# EasyEDA Pro project 扩展30.5V0.25_AT32F435_2025-06-26.epro, board IFLIGHT435/405_0.25
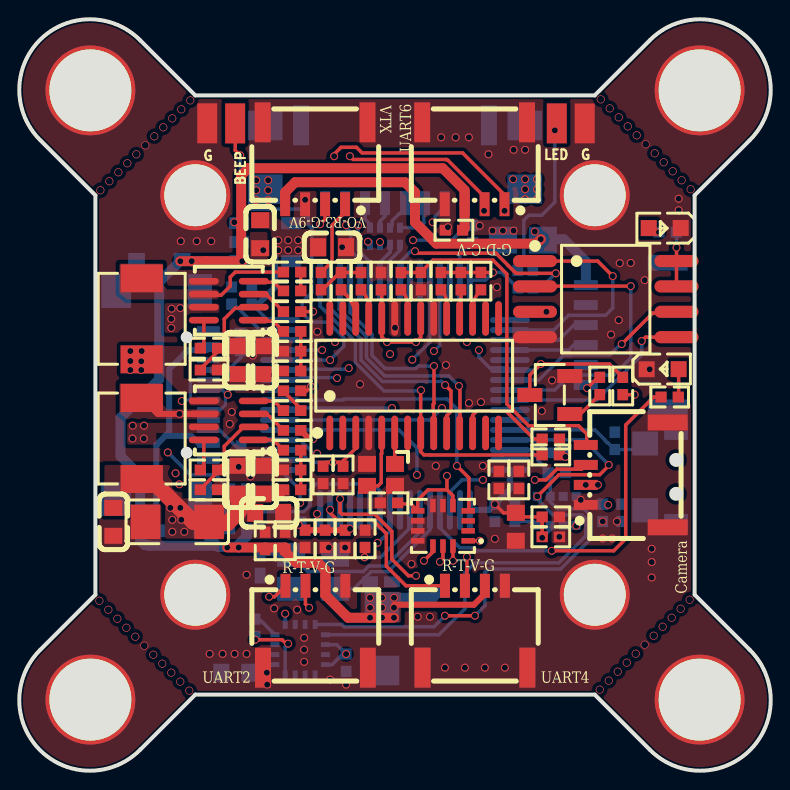
[diagram p1: board, top side]
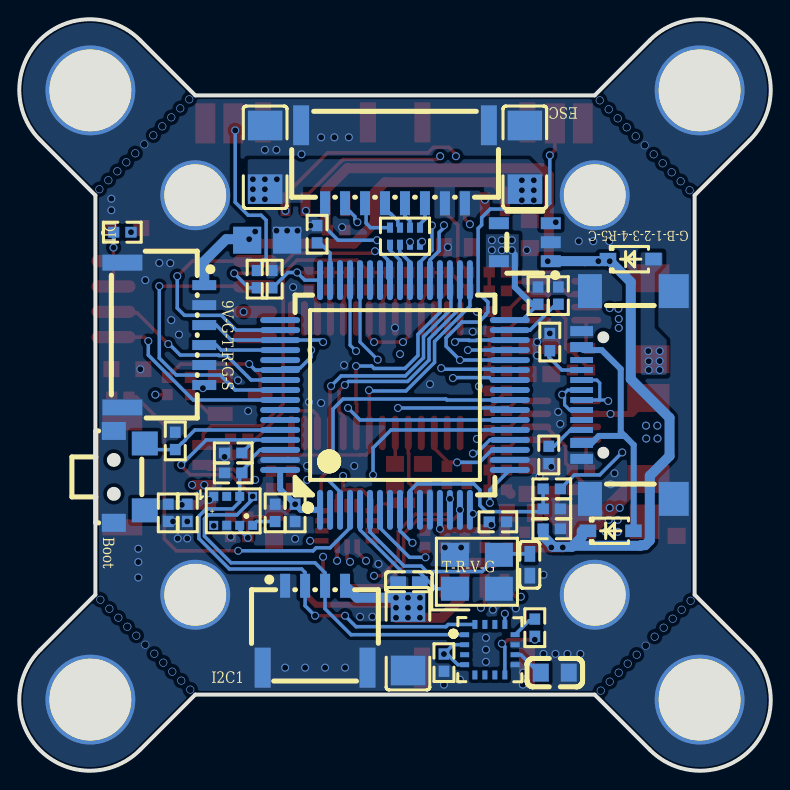
[diagram p2: board, bottom side, seen from below]

Outline 37.62 x 37.62 mm; copper layers: Top Layer, Inner1, Inner2, Bottom Layer. Coordinates in mm from the lower left corner of the outline.
Outline path: 1.06,31.56 arc(1.04,36.59) 6.06,36.56 8.81,33.81 28.81,33.81 31.56,36.56 arc(36.59,36.59) 36.56,31.56 33.81,28.82 33.81,8.81 36.56,6.06 arc(36.59,1.04) 31.56,1.06 28.81,3.81 8.81,3.81 6.06,1.06 arc(1.04,1.04) 1.06,6.06 3.81,8.81 3.81,28.81 1.06,31.56
Stack: Top Layer 0.035mm 外层铜厚1oz / Dielectric1 0.2104mm 7628 RC49% 8.6mil / Inner1 0.0152mm 内层铜厚 / Dielectric2 1.065mm 1.1mm H/HOZ Copper / Inner2 0.0152mm 内层铜厚 / Dielectric3 0.2104mm 7628 RC49% 8.6mil / Bottom Layer 0.035mm 外层铜厚1oz

## Design rules (mm)
net OTG_FS_DP: DP1
net OTG_FS_DM: DP1
template: 自定义配置
spacing copperThickness1oz (default): track to track 0.102, other pairs 0 to 0.3
spacing copperThickness2oz: track to track 0.203, other pairs 0.152 to 0.3
track width copperThickness1oz (default): min 0.127, default 0.175, max 2.54
track width copperThickness2oz: min 0.203, default 0.254, max 2.54
differential pair differentialPair (default): width min 0.127, default 0.16, max 2.54; gap min 0.152, default 0.152
via viaSize (default): diameter min 0.4, default 0.4, max 10; hole min 0.3, default 0.3, max 6.3

## Placement (name value [footprint] x y rotation side)
BEEP  BEEPER  [Test-Point-0.5mm]  10.81 32.41 0 top
C1  100nF  [R0402]  24.96 24.61 90 bottom
C2  100nF  [R0402]  23.81 12.91 270 bottom
C3  100nF  [R0402]  11.65 23.79 90 bottom
C4  100nF  [R0402]  13.66 12.46 180 bottom
C5  100nF  [R0402]  25.01 14.56 90 top
C6  1uF  [R0402]  24.01 14.56 90 top
C7  100nF  [R0402]  12.31 11.51 90 top
C8  100nF  [R0402]  13.31 11.51 90 top
C9  100nF  [R0402]  21.76 27.06 0 top
C10  2.2uF  [R0402]  10.96 12.11 0 bottom
C11  100nF  [C0603]  12.06 26.86 90 top
C12  22uF  [C0603]  15.66 26.21 180 top
C13  100nF  [R0402]  17.31 11.61 90 top
C14  15pF  [C0402#2]  18.11 9.46 180 bottom
C15  15pF  [C0402#2]  12.06 10.31 90 bottom
C16  100nF  [C0402]  9.5 20.07 180 top
C17  100nF  [C0402]  9.5 14.07 180 top
C18  22uF  [C0603]  12.18 20.56 270 top
C19  22uF  [C0603]  10.99 20.56 270 top
C20  22uF  [C0603]  10.99 14.57 270 top
C21  100nF  [C0603]  12.51 12.91 180 top
C22  22uF  [C0603]  12.18 14.57 270 top
C23  47uF  [C1206]  25.31 30.71 270 bottom
C24  47uF  [C1206]  12.31 30.71 270 bottom
C25  100nF  [C0402]  13.66 24.03 0 top
C26  100nF  [C0402]  13.66 18.03 0 top
C27  2.2uF  [R0402]  10.64 23.79 90 bottom
C28  2.2uF  [R0402]  22.71 26.86 90 bottom
C29  47uF  [C1206]  18.16 6.61 90 bottom
C30  47uF  [C1206]  7.91 12.46 0 top
C31  100nF  [C0402]  30.16 12.91 90 bottom
C32  100nF  [C0402]  29.21 12.91 90 bottom
C33  4.7uF  [C0603]  24.86 12.21 90 top
C34  4.7uF  [C0603]  4.71 12.46 270 top
C35  100nF  [C0402]  18.11 24.51 90 top
C36  100nF  [C0402]  15.21 14.81 270 top
C37  100nF  [C0402]  16.21 14.81 270 top
C38  22uF  [C0805]  25.21 26.56 0 bottom
C39  100nF  [C0402]  15.31 11.61 90 top
C40  10nF  [C0402]  16.31 11.61 90 top
C41  100nF  [R0402]  18.51 13.41 180 top
C42  100nF  [R0402]  14.31 11.61 270 top
C43  100nF  [R0402]  26.61 12.71 0 top
C44  100nF  [R0402]  26.61 11.71 0 top
C45  22uF  [C0402]  16.11 24.51 90 top
C46  22uF  [C0402]  17.11 24.51 90 top
C47  100nF  [C0402]  19.11 24.51 90 top
C49  4.7uF  [C0603]  10.81 4.91 180 bottom
C50  100nF  [C0402]  16.36 5.41 270 bottom
C51  220nF  [C0402]  11.81 7.16 270 bottom
CN2  HDGC1002WR-S-4P  [CONN-SMD_4P-P1.00_HDGC_HDGC1002WR-S-4P]  14.81 30.41 180 top
CN3  HDGC1002WR-S-4P  [CONN-SMD_4P-P1.00_HDGC_HDGC1002WR-S-4P]  14.83 7.21 0 top
CN4  HDGC1002WR-S-4P  [CONN-SMD_4P-P1.00_HDGC_HDGC1002WR-S-4P]  30.41 14.81 90 top
CN5  HDGC1002WR-S-4P  [CONN-SMD_4P-P1.00_HDGC_HDGC1002WR-S-4P]  22.81 7.21 0 top
CN6  HDGC1002WR-S-4P  [CONN-SMD_4P-P1.00_HDGC_HDGC1002WR-S-4P]  22.81 7.21 180 bottom
CN7  HDGC1002WR-S-8P  [CONN-SMD_8P-P1.00_HDGC_HDGC1002WR-S-8P]  18.81 30.37 0 bottom
CN9  HDGC1002WR-S-6P  [CONN-SMD_6P-P1.00_HDGC1002WR-S-6P]  30.41 21.81 270 bottom
CN10  HDGC1002WR-S-4P  [CONN-SMD_4P-P1.00_HDGC_HDGC1002WR-S-4P]  22.8 30.41 180 top
D1  BAT60B  [SOD-323_L1.7-W1.3-LS2.6-RD-1]  7.01 25.61 180 bottom
D2  BAT60B  [SOD-323_L1.7-W1.3-LS2.6-RD-1]  8.01 12.01 180 bottom
G  -  [Test-Point-0.5mm]  28.31 32.41 0 top
G#2  -  [Test-Point-0.5mm]  9.41 32.41 0 top
L1  10uH  [IND-SMD_L4.4-W4.2]  6.13 22.63 90 top
L2  10uH  [IND-SMD_L4.4-W4.2]  6.13 16.64 90 top
LED  LED_STRIP  [Test-Point-0.5mm]  26.91 32.41 0 top
LED4  -  [LED_0603]  32.26 27.16 180 top
LED5  -  [LED_0603]  32.26 20.11 0 top
NOREF  -  [Pad_e2428]  3.56 34.06 0 top
NOREF#2  -  [Pad_e188]  8.81 28.81 0 top
NOREF#3  -  [Pad_e187]  8.81 8.81 0 top
NOREF#4  -  [Pad_e183]  28.81 28.81 0 top
NOREF#5  -  [Pad_e2430]  34.06 3.56 0 top
NOREF#6  -  [Pad_e2431]  3.56 3.56 0 top
NOREF#7  -  [Pad_e186]  28.81 8.81 0 top
NOREF#8  -  [Pad_e2429]  34.06 34.06 0 top
Q1  SS8050_C2150  [SOT-23-3_L2.9-W1.3-P1.90-LS2.4-BR]  26.56 18.81 0 top
R1  10kΩ  [R0402]  29.81 16.51 90 bottom
R2  10kΩ  [R0402]  10.96 14.11 180 bottom
R3  1kΩ  [R0402]  10.96 13.11 0 bottom
R4  100kΩ  [R0402]  9.5 21.16 180 top
R5  100kΩ  [R0402]  9.5 15.06 180 top
R6  1MΩ  [R0402]  13.66 22.99 180 top
R7  1MΩ  [R0402]  13.66 17.04 180 top
R8  20Ω  [R0402]  13.66 24.97 0 top
R9  20Ω  [R0402]  13.66 19.02 180 top
R10  10kΩ  [R0402]  26.91 14.91 180 bottom
R11  3kΩ  [R0402]  25.71 24.61 90 bottom
R12  10kΩ  [R0402]  26.91 15.91 180 bottom
R13  3kΩ  [R0402]  32.56 18.71 0 top
R14  3kΩ  [R0402]  32.46 26.96 180 bottom
R15  51kΩ  [R0402]  13.66 22 0 top
R16  41.2kΩ  [R0402]  13.66 20.02 180 top
R17  51kΩ  [R0402]  13.66 16.05 0 top
R18  41.2kΩ  [R0402]  13.66 14.07 180 top
R19  7.68kΩ  [R0402]  13.66 21.01 0 top
R20  4.02kΩ  [R0402]  13.66 15.06 0 top
R21  100kΩ  [R0402]  24.81 12.91 270 bottom
R22  5.1kΩ  [R0402]  11.11 15.81 90 bottom
R23  5.1kΩ  [R0402]  11.06 21.46 270 bottom
R24  1k  [R0402]  26.61 16.61 0 top
R25  1k  [R0402]  22.11 24.51 90 top
R26  1k  [R0402]  23.11 24.51 90 top
R27  10k  [R0402]  21.11 24.51 90 top
R28  10k  [R0402]  26.61 15.81 0 top
R29  10kΩ  [R0402]  30.21 19.26 90 top
R30  75  [R0402]  15.11 24.51 90 top
R31  2K  [R0402]  29.06 19.26 270 top
R32  75  [R0402]  20.11 24.51 270 top
RN1  47Ω  [RES-ARRAY-SMD_0402-8P-L2.0-W1.0-BL]  18.31 26.76 180 bottom
SW1  TS24CA  [SW-SMD_TS24CA]  32.11 14.71 90 bottom
U1  ME6217C33M5G  [SOT-23-5_L3.0-W1.7-P0.95-LS2.8-BR]  12.31 26.46 180 bottom
U2  MP9943GQ-Z  [QFN-8_L3.0-W3.0-P0.65-BL]  10.49 23.54 90 top
U3  MP9943GQ-Z  [QFN-8_L3.0-W3.0-P0.65-BL]  10.49 17.54 90 top
U4  SPL06-001  [SENSOR-SMD_SPL06-001]  26.91 13.01 0 bottom
U5  AT7456E  [AT7456E-SHORTER-FOOTPRINT]  19.77 19.78 0 top
U6  ICM-42688-P  [LGA-14_L3.0-W2.5-P0.50-TL]  21.21 12.26 180 top
U8  STM32F405RGT6/AT32F435RGT6  [LQFP-64_L10.0-W10.0-P0.50-LS12.0-BL]  18.81 18.81 180 bottom
U9  W25Q64JVSSIQ  [SOP-8_L5.3-W5.3-P1.27-LS8.0-BL]  29.36 23.61 270 top
U10  QMC5883L  [LGA-16_L3.0-W3.0-P0.50-BL_SQ]  14.06 6.06 270 bottom
USB1  TYPE-C 16P QTWT  [USB-TYPE-C-SMD_TYPE-C-16P-QTWT]  7.16 18.81 90 bottom
X1  Crystal2016  [CRYSTAL2016]  18.11 14.81 0 top
X2  8MHz  [CRYSTAL-SMD_4P-L3.2-W2.5-BL]  14.71 9.96 180 bottom

## Footprints (pads in the part's own frame, mm; a bottom-side part is the same pattern mirrored in y, then rotated)
AT7456E-SHORTER-FOOTPRINT
  oval 0.343x1.732 smd: 1(-4.225,-2.866) 2(-3.575,-2.866) 3(-2.925,-2.866) 4(-2.275,-2.866) 5(-1.625,-2.866) 6(-0.975,-2.866) 7(-0.325,-2.866) 8(0.325,-2.866) 9(0.975,-2.866) 10(1.625,-2.866) 11(2.275,-2.866) 12(2.925,-2.866) 13(3.575,-2.866) 14(4.225,-2.866) 15(4.225,2.865) 16(3.575,2.865) 17(2.925,2.865) 18(2.275,2.865) 19(1.625,2.865) 20(0.975,2.865) 21(0.325,2.865) 22(-0.325,2.865) 23(-0.975,2.865) 24(-1.625,2.865) 25(-2.275,2.865) 26(-2.925,2.865) 27(-3.575,2.865) 28(-4.225,2.865)
C0402
  rect 0.567x0.54 smd: 1(-0.432,0) 2(0.432,0)
C0402#2
  rect 0.79x0.54 smd: 1(-0.545,0) 2(0.545,0)
C0603
  rect 0.8x0.9 smd: 1(-0.7,0) 2(0.7,0)
C0805
  rect 1.41x1.35 smd: 1(-1,0) 2(1,0)
C1206
  rect 1.485x1.728 smd: 1(-1.593,0) 2(1.593,0)
CONN-SMD_4P-P1.00_HDGC_HDGC1002WR-S-4P
  rect 0.5x1.2 smd: 1(-1.5,2.05) 2(-0.5,2.05) 3(0.5,2.05) 4(1.5,2.05)
  rect 0.8x2 smd: 5(2.625,-2.05) 6(-2.625,-2.05)
CONN-SMD_6P-P1.00_HDGC1002WR-S-6P
  rect 0.5x1.2 smd: 1(-2.5,2.05) 2(-1.5,2.05) 3(-0.5,2.05) 4(0.5,2.05) 5(1.5,2.05) 6(2.5,2.05)
  rect 0.8x2 smd: 7(3.625,-2.05) 8(-3.625,-2.05)
CONN-SMD_8P-P1.00_HDGC_HDGC1002WR-S-8P
  rect 0.5x1.2 smd: 1(-3.5,1.95) 2(-2.5,1.95) 3(-1.5,1.95) 4(-0.5,1.95) 5(0.5,1.95) 6(1.5,1.95) 7(2.5,1.95) 8(3.5,1.95)
  rect 0.8x2 smd: 9(4.7,-1.95) 10(-4.7,-1.95)
CRYSTAL2016
  custom 0.9x0.8 smd: 1(0.7,0.55) 2(-0.7,0.55) 3(-0.7,-0.55) 4(0.7,-0.55)
CRYSTAL-SMD_4P-L3.2-W2.5-BL
  rect 1.4x1.2 smd: 1(-1.1,-0.85) 2(1.1,-0.85) 3(1.1,0.85) 4(-1.1,0.85)
IND-SMD_L4.4-W4.2
  rect 1.4x2.12 smd: 1(2.028,0) 2(-2.028,0)
LED_0603
  rect 0.8x0.8 smd: 1(-0.851,-0.01) 2(0.75,-0.005)
LGA-14_L3.0-W2.5-P0.50-TL
  rect 0.675x0.28 smd: 1(-1.262,0.75) 2(-1.262,0.25) 3(-1.262,-0.25) 4(-1.262,-0.75) 8(1.262,-0.75) 9(1.262,-0.25) 10(1.262,0.25) 11(1.262,0.75)
  rect 0.28x0.675 smd: 5(-0.5,-1.012) 6(0,-1.012) 7(0.5,-1.012) 12(0.5,1.012) 13(0,1.012) 14(-0.5,1.012)
LGA-16_L3.0-W3.0-P0.50-BL_SQ
  rect 0.25x0.45 smd: 1(-0.75,-1.263) 2(-0.25,-1.263) 3(0.25,-1.263) 4(0.75,-1.263) 9(0.75,1.263) 10(0.25,1.263) 11(-0.25,1.263) 12(-0.75,1.263)
  rect 0.45x0.25 smd: 5(1.263,-0.75) 6(1.263,-0.25) 7(1.263,0.25) 8(1.263,0.75) 13(-1.263,0.75) 14(-1.263,0.25) 15(-1.263,-0.25) 16(-1.263,-0.75)
LQFP-64_L10.0-W10.0-P0.50-LS12.0-BL
  oval 0.3x2 smd: 1(-3.75,-5.75) 2(-3.25,-5.75) 3(-2.75,-5.75) 4(-2.25,-5.75) 5(-1.75,-5.75) 6(-1.25,-5.75) 7(-0.75,-5.75) 8(-0.25,-5.75) 9(0.25,-5.75) 10(0.75,-5.75) 11(1.25,-5.75) 12(1.75,-5.75) 13(2.25,-5.75) 14(2.75,-5.75) 15(3.25,-5.75) 16(3.75,-5.75) 33(3.75,5.75) 34(3.25,5.75) 35(2.75,5.75) 36(2.25,5.75) 37(1.75,5.75) 38(1.25,5.75) 39(0.75,5.75) 40(0.25,5.75) 41(-0.25,5.75) 42(-0.75,5.75) 43(-1.25,5.75) 44(-1.75,5.75) 45(-2.25,5.75) 46(-2.75,5.75) 47(-3.25,5.75) 48(-3.75,5.75)
  oval 2x0.3 smd: 17(5.75,-3.75) 18(5.75,-3.25) 19(5.75,-2.75) 20(5.75,-2.25) 21(5.75,-1.75) 22(5.75,-1.25) 23(5.75,-0.75) 24(5.75,-0.25) 25(5.75,0.25) 26(5.75,0.75) 27(5.75,1.25) 28(5.75,1.75) 29(5.75,2.25) 30(5.75,2.75) 31(5.75,3.25) 32(5.75,3.75) 49(-5.75,3.75) 50(-5.75,3.25) 51(-5.75,2.75) 52(-5.75,2.25) 53(-5.75,1.75) 54(-5.75,1.25) 55(-5.75,0.75) 56(-5.75,0.25) 57(-5.75,-0.25) 58(-5.75,-0.75) 59(-5.75,-1.25) 60(-5.75,-1.75) 61(-5.75,-2.25) 62(-5.75,-2.75) 63(-5.75,-3.25) 64(-5.75,-3.75)
Pad_e183
  round 3.5 hole 3.1: 1(0,0)
Pad_e186
  round 3.5 hole 3.1: 1(0,0)
Pad_e187
  round 3.5 hole 3.1: 1(0,0)
Pad_e188
  round 3.5 hole 3.1: 1(0,0)
Pad_e2428
  round 4.5 hole 4.1: 1(0,0)
Pad_e2429
  round 4.5 hole 4.1: 1(0,0)
Pad_e2430
  round 4.5 hole 4.1: 1(0,0)
Pad_e2431
  round 4.5 hole 4.1: 1(0,0)
QFN-8_L3.0-W3.0-P0.65-BL
  oval 0.33x1.5 smd: 1(-0.975,-1.25) 2(-0.325,-1.25) 3(0.325,-1.25) 4(0.975,-1.25) 5(0.975,1.25) 6(0.325,1.25) 7(-0.325,1.25) 8(-0.975,1.25)
R0402
  rect 0.566x0.54 smd: 1(-0.433,0) 2(0.433,0)
RES-ARRAY-SMD_0402-8P-L2.0-W1.0-BL
  rect 0.3x0.505 smd: 1(-0.75,0.427) 2(-0.25,0.427) 3(0.25,0.427) 4(0.75,0.427) 5(0.75,-0.427) 6(0.25,-0.427) 7(-0.25,-0.427) 8(-0.75,-0.427)
SENSOR-SMD_SPL06-001
  rect 0.45x0.45 smd: 1(0.975,-0.725) 2(0.325,-0.725) 3(-0.325,-0.725) 4(-0.975,-0.725) 5(-0.975,0.725) 6(-0.325,0.725) 7(0.325,0.725) 8(0.975,0.725)
SOD-323_L1.7-W1.3-LS2.6-RD-1
  rect 0.83x0.63 smd: 1(-1.14,0) 2(1.14,0)
SOP-8_L5.3-W5.3-P1.27-LS8.0-BL
  oval 0.609x2.204 smd: 1(-1.905,-3.542) 2(-0.635,-3.542) 3(0.635,-3.542) 4(1.905,-3.542) 5(1.905,3.542) 6(0.635,3.542) 7(-0.635,3.542) 8(-1.905,3.542)
SOT-23-3_L2.9-W1.3-P1.90-LS2.4-BR
  rect 1.25x0.7 smd: 1(1,-0.95) 2(1,0.95) 3(-1,0)
SOT-23-5_L3.0-W1.7-P0.95-LS2.8-BR
  rect 1x0.6 smd: 1(1.3,-0.95) 2(1.3,0) 3(1.3,0.95) 4(-1.3,0.95) 5(-1.3,-0.95)
SW-SMD_TS24CA
  rect 0.9x1.2 smd: 1(-2.3,0.775) 2(2.3,0.775)
  rect 1.2x1.3 smd: 3(-1.675,-0.775) 4(1.675,-0.775)
Test-Point-0.5mm
  rect 1x2 smd: 1(0,0)
USB-TYPE-C-SMD_TYPE-C-16P-QTWT
  rect 1.7x1.5 smd: 0(-5.2,-2.309) 0(5.2,-2.309)
  rect 1.7x1.2 smd: 0(-5.2,1.891) 0(5.2,1.891)
  rect 0.5x1.14 smd: A1(-3.2,2.308) A4(-2.4,2.308) A9(2.4,2.308) A12(3.2,2.308)
  rect 0.3x1.14 smd: A5(-1.25,2.308) A6(-0.25,2.308) A7(0.25,2.308) A8(1.25,2.309) B5(1.75,2.308) B6(0.75,2.308) B7(-0.75,2.308) B8(-1.75,2.309)

## Nets
As in the schematic, except:
GND: C1.2 C2.2 C3.2 C4.2 C5.2 C6.2 C7.2 C8.2 C9.1 C10.1 C11.1 C12.1 C13.2 C14.1 C15.1 C16.1 C17.1 C18.1 C19.1 C20.1 C21.1 C22.1 C23.1 C24.1 C27.2 C28.2 C29.1 C30.1 C31.1 C32.1 C33.1 C34.2 C35.2 C36.2 C37.2 C38.1 C39.1 C40.1 C41.2 C42.2 C43.2 C44.2 C49.2 C50.2 CN2.3 CN2.5 CN2.6 CN3.4 CN3.5 CN3.6 CN4.1 CN4.5 CN4.6 CN5.4 CN5.5 CN5.6 CN6.1 CN6.5 CN6.6 CN7.1 CN7.9 CN7.10 CN9.2 CN9.5 CN9.7 CN9.8 CN10.4 CN10.5 CN10.6 G.1 G#2.1 LED4.1 LED5.1 NOREF.1 NOREF#2.1 NOREF#3.1 NOREF#4.1 NOREF#5.1 NOREF#6.1 NOREF#7.1 NOREF#8.1 Q1.2 R1.2 R3.1 R19.1 R20.1 R21.1 R22.1 R23.1 R32.2 SW1.1 SW1.2 U1.2 U2.5 U3.5 U4.1 U4.7 U5.4 U5.20 U5.23 U6.6 U6.7 U6.9 U6.10 U6.11 U8.12 U8.18 U8.63 U9.4 U10.9 U10.11 USB1.0 USB1.A1 USB1.A12 X1.2 X1.4 X2.2 X2.4
BEEPER: BEEP.1 U8.28
$1N22855: LED.1 R11.2

Pads without a net: U1 4; U4 2; U5 1 2 7 13 14 15 16 27 28; U6 2 3; U8 2 8 11 46 49; U10 3 5 6 7 14 15; USB1 A5 B5

## Via types
v1: diameter 0.4, hole 0.35, Top Layer to Bottom Layer, 44 vias
v2: diameter 0.4, hole 0.3, Top Layer to Bottom Layer, 224 vias

## Routing (per net, layer and track width the routed paths; a pad name or vN(x,y) marks a point on that pad's centre or on a via; arc(x,y) is an arc through that point)
4V5: length 65.6
  Top Layer w0.3: CN5.3 23.31,8.86 22.76,8.31 18.76,8.31
  Top Layer w0.5: 9.32,25.51 v2(8.06,25.51) ; 9.32,25.51 v2(11.17,25.51) 11.11,25.57 11.11,29.81 11.47,30.17 21.2,30.17 22.3,29.07 CN10.3 22.3,27.17 22.2,27.06 ; 9.32,25.51 9.31,25.51 ; v2(18.76,7.66) v2(18.16,7.66) v2(17.56,7.66) 16.46,7.66 15.33,8.8 CN3.3 15.33,10.05 14.96,10.41 13.86,10.41 13.31,10.96 13.31,11.18 v2(10.99,11.18) v2(10.41,11.18)
  Bottom Layer w0.5: 9.9,11.26 9.95,11.21 10.86,11.21 11.4,11.75 C10.2 ; 9.9,11.26 6.51,11.26 6.48,11.3 6.29,11.3 6.06,11.53 6.06,14.77 5.07,15.76 5.07,17.67 7.01,19.61 7.01,24.47 D1.1 8.25,25.51 v2(8.63,25.51) U1.1 ; 9.9,11.26 9.46,11.71 9.47,11.72 9.47,12.01 ; v2(18.76,8.66) 20.71,8.66 CN6.4
  vias: v2(10.76,27.46) v2(17.56,8.66) v2(17.56,8.16) v2(18.16,8.66) v2(18.16,8.16) v2(18.76,8.16)
5V_BEC: length 1.1
  Top Layer w0.175: R16.2 12.38,20.02 12.18,19.81
  vias: v2(5.56,21.01) v2(5.56,20.51) v2(5.56,20.06) v2(6.13,21.01) v2(6.11,20.5) v2(6.11,20.06)
5V_USB: length 13.2
  Bottom Layer w0.3: 7.31,16.76 8.61,16.76 8.96,16.41 9.52,16.41 ; 7.31,16.76 7.51,16.96 7.51,20.11 8.46,21.06 9.37,21.06 9.52,21.21 ; 7.31,16.76 6.86,16.31 6.86,12.02 D2.2
9V_BEC: length 96.5
  Top Layer w0.5: v2(26.11,26.61) 25.89,26.39 20.88,26.39 19.81,27.46 19.81,28.96 19.31,29.46 13.81,29.46 13.31,28.96 CN2.4 ; R18.2 13.03,13.87
  Top Layer w0.8: C20.2 10.99,12.96 10.42,12.4 9.57,12.4 C30.2 8.71,12.46 6.57,14.61 L2.2
  Inner2 w0.7: 27.9,14.31 v2(28.36,14.31) v2(28.97,14.31)
  Inner2 w0.8: 28.26,14.36 28.26,16.01 27.68,16.6 27.68,25.65 ; 27.68,25.65 28.91,25.65 31.12,27.86 31.12,29.77 28.07,32.81 9.56,32.81 4.56,27.82 4.56,14.81 6.81,12.56 v2(7.66,12.56) v2(8.11,12.56) 8.86,12.56 ; 27.68,25.65 26.71,26.61 v2(26.11,26.61) 25.81,26.91 v2(25.81,27)
  Bottom Layer w0.5: CN9.1 28.36,25.51 27.26,26.61 v2(26.11,26.61)
  Bottom Layer w0.8: v2(26.11,26.61) 26.16,26.56 C38.2
  vias: v2(7.56,13.16) v2(7.66,11.96) v2(8.06,13.16) v2(8.26,11.96)
GND: length 0.9
  Top Layer w0.175: 18.8,22.65 18.8,23.56
  vias: v1(6.26,6.26) v1(6.31,31.31) v1(31.31,6.31) v1(31.36,31.36) v2(7.83,14.9) v2(8.02,14.34) v2(8.09,26.51) v2(8.89,26.51) v2(9.54,5.85) v2(9.61,26.51) v2(10.18,5.85) v2(10.54,17.37) v2(10.64,17.97) v2(10.78,5.85) v2(11.06,21.9) v2(10.99,15.22) v2(11.38,9.81) v2(11.38,5.85) v2(11.58,14.74) v2(11.7,21.46) v2(11.7,20.79) v2(12.21,26.06) v2(12.4,4.91) v2(12.41,4.31) v2(12.76,8.13) v2(13.91,8.06) v2(14.26,6.66) v2(14.26,6.06) v2(14.26,5.45) v2(14.31,28.59) v2(14.92,21.98) v2(15.5,11.18) v2(15.56,4.56) v2(16.16,26.21) v2(16.31,11.18) v2(16.36,4.31) v2(17.06,19.36) v2(18.81,22.18) v2(19.64,10.36) v2(19.95,7.71) v2(20.56,7.71) v2(20.85,15.26) v2(21.12,31.71) v2(21.31,5.16) v2(21.36,20.31) v2(21.46,27.22) v2(21.85,31.71) v2(22.31,5.16) v2(22.51,31.71) v2(22.51,18.41) v2(23.06,27.29) v2(23.12,18.46) v2(23.21,15.26) v2(23.31,5.16) v2(23.5,30.87) v2(23.7,27.04) v2(23.81,11.61) v2(23.91,24.21) v2(24.21,27.04) v2(24.31,5.16) v2(24.75,31.09) v2(24.75,27.04) v2(25.33,31.09) v2(26.16,18.01) v2(26.68,19.55) v2(27.04,11.71) v2(28.11,13.56) v2(29.21,12.48) v2(29.21,11.63) v2(29.63,21.84) v2(29.69,11.63) v2(29.93,12.48) v2(30.06,25.41) v2(30.01,22.56) v2(30.61,25.43) v2(31.31,24.56) v2(31.56,20.1) v2(31.66,11.11) v2(31.66,10.45) v2(31.66,9.68) v2(33.01,28.64) v2(33.01,28.06)
VBAT: length 37.9
  Top Layer w0.175: R6.1 v2(14.71,22.99)
  Top Layer w0.3: v2(14.71,16.61) 14.53,16.61 R7.1
  Inner2 w0.175: v2(7.44,15.94) 6.76,16.61 ; v2(14.71,22.99) 8.24,22.99 v2(8.06,23.16)
  Inner2 w0.5: v2(6.24,16.64) 6.26,16.61 8.13,16.61 8.14,16.63 8.73,16.63 8.74,16.61 v2(14.71,16.61)
  Inner2 w0.8: 11.86,28.46 11.86,27.37 v2(7.63,23.13)
  Inner2 w1: 5.96,16.16 5.96,18.23 6.99,19.25 6.99,22.14 7.63,22.78 v2(7.63,23.13) ; 11.81,28.51 v2(11.86,28.56) v2(11.86,29.06) v2(11.86,29.56) v2(12.46,29.56) ; 11.86,28.51 11.86,28.46
  Bottom Layer w0.175: R2.2 9.83,14.81 8.56,14.81 v2(7.44,15.94)
  vias: v2(5.68,17.28) v2(5.67,16.64) v2(6.25,17.28) v2(7.61,22.62) v2(7.61,22.17) v2(12.46,29.06) v2(12.46,28.56) v2(24.73,29.62) v2(25.33,29.62) v2(25.33,29.12) v2(25.33,28.62) v2(25.93,29.62) v2(25.93,29.12) v2(25.93,28.62)
VDD_MCU: length 44
  Top Layer w0.175: R29.1 v2(30.81,18.83) ; U9.7 U9.8 v2(32.91,26.19) ; U5.3 16.85,16.15 16.21,15.51 C37.1 16.02,15.44 v2(15.7,15.44) 15.41,15.44 C36.1 ; 21.42,14.06 20.46,14.06 19.95,13.55 U6.8 19.6,13.36 18.95,13.36 ; 21.42,14.06 21.71,13.77 U6.5 ; 21.42,14.06 21.41,14.07 v2(21.41,14.76) ; 20.1,22.65 20.1,21.7 v2(19.86,21.46) v2(18.41,21.46) 18.15,21.73 18.15,24.05 C35.1 ; v2(26.18,11.66) C44.1 C43.1 25.06,12.71 C33.2 24.25,12.91 v2(23.81,13.35) ; 27.05,16.71 27.05,15.71 ; 21.11,24.95 v2(23.71,24.95)
  Top Layer w0.3: C40.2 C39.2 C42.1
  Bottom Layer w0.175: U8.19 13.97,16.06 14.59,15.44 v2(15.7,15.44) ; U4.6 26.59,12.07 v2(26.18,11.66) ; 32.9,26.86 32.91,26.86 v2(32.91,26.19) ; U10.4 15.66,5.31 16.2,5.85 v2(16.36,5.85) 15.9,6.31 U10.2 ; U10.13 v2(13.31,7.86) ; 11.65,23.36 12.44,22.56 U8.32 ; U8.48 23.33,24.56 v2(23.71,24.95) 24.17,24.95 24.94,24.18 24.96,24.18 ; U4.8 v2(27.89,12.26)
  Bottom Layer w0.3: 11.65,23.36 11.96,23.36 12.81,24.21 12.81,25.86 ; U8.1 23.42,13.06 23.42,13.07 23.53,13.07 v2(23.81,13.35) 24.56,14.1 U8.64
  vias: v2(12.97,26.56) v2(12.97,26.06) v2(13.47,26.56) v2(13.47,26.06) v2(13.97,26.56) v2(13.97,26.06) v2(13.99,12.31) v2(16.56,12.11) v2(26.39,22.98) v2(27.35,15.72) v2(29.49,13.31)
(no net):
  vias: v1(4.06,29.06) v1(4.01,8.51) v1(4.51,29.51) v1(4.46,8.06) v1(4.91,7.61) v1(4.96,29.96) v1(5.41,30.41) v1(5.36,7.16) v1(5.81,6.71) v1(5.86,30.86) v1(6.76,31.76) v1(6.71,5.81) v1(7.16,5.36) v1(7.21,32.21) v1(7.66,32.66) v1(7.61,4.91) v1(8.06,4.46) v1(8.11,33.11) v1(8.51,4.01) v1(8.56,33.56) v1(29.06,4.06) v1(29.11,33.61) v1(29.51,4.51) v1(29.56,33.16) v1(30.01,32.71) v1(29.96,4.96) v1(30.41,5.41) v1(30.46,32.26) v1(30.91,31.81) v1(30.86,5.86) v1(31.76,6.76) v1(31.81,30.91) v1(32.26,30.46) v1(32.21,7.21) v1(32.66,7.66) v1(32.71,30.01) v1(33.16,29.56) v1(33.11,8.11) v1(33.61,29.11) v1(33.56,8.56)
BEEPER: length 19.4
  Top Layer w0.175: BEEP.1 10.81,32.41 10.81,31.06 v2(11.06,30.81)
  Bottom Layer w0.175: U8.28 v2(15.56,20.56) 16.25,21.25 16.25,21.68 15.46,22.46 14.62,22.46 14.28,22.81 14.28,22.85 14.16,22.96 14.16,23.46 14.65,23.95 14.65,27.16 14.48,27.33 14.48,27.69 14.04,28.13 11.37,28.13 11.06,28.43 v2(11.06,30.81)
BOOT: length 7.3
  Bottom Layer w0.175: SW1.4 31.03,16.08 R1.1 29.47,16.43 29.45,16.43 29.31,16.57 29.31,16.59 28.83,17.06 U8.60
CAM: length 17.5
  Top Layer w0.175: C47.2 20.1,24.95 20.71,25.56 23.72,25.56 24.41,24.87 24.41,18.36 25.5,17.28 28,17.28 28.41,16.86 28.41,16.36 CN4.4
FB_5V: length 1.7
  Top Layer w0.175: R15.1 12.72,22.51 11.74,22.51
FB_9V: length 1.7
  Top Layer w0.175: U3.1 12.72,16.57 R17.1
I2C1_SCL: length 30.6
  Top Layer w0.175: v2(25.94,13.74) 27.03,14.83 29.06,14.83 29.51,15.28 v2(29.51,15.31)
  Bottom Layer w0.175: U10.1 21.01,6.81 22.31,8.11 CN6.3 22.31,9.91 22.81,10.41 27.02,10.41 28.35,11.75 28.35,12.61 28.31,12.65 28.31,12.66 28.16,12.81 26.73,12.81 25.94,13.6 v2(25.94,13.74) ; 25.83,16.56 R12.2 ; 25.83,16.56 28.26,16.56 v2(29.51,15.31) ; 25.83,16.56 U8.61
I2C1_SDA: length 24.1
  Top Layer w0.175: v2(21.31,7.76) v2(22.81,7.76)
  Bottom Layer w0.175: v2(22.81,7.76) 23.31,8.26 CN6.2 23.31,9.93 23.49,10.1 27.1,10.1 28.63,11.63 28.63,12.75 28.27,13.11 26.94,13.11 26.59,13.46 U4.3 26.59,14.81 R10.2 26.48,15.02 25.96,15.55 25.96,15.67 25.56,16.06 U8.62 ; v2(21.31,7.76) 20.76,7.21 16.26,7.21 16.15,7.33 U10.16
LC_5V: length 4.7
  Top Layer w0.175: 9.24,23.81 10.11,23.81 10.56,24.26 10.56,24.71 10.82,24.97 R8.1
LC_9V: length 12.1
  Top Layer w0.175: R9.1 14.39,19.02 v2(14.61,19.25)
  Top Layer w0.3: 9.24,17.87 v2(8.03,17.87) 6.93,17.87 L2.1
  Inner1 w0.175: v2(8.03,17.87) 9.08,16.81 12.13,16.81 14.56,19.25 v2(14.61,19.25)
LED0: length 19
  Top Layer w0.175: v2(26.66,11.01) 29.76,11.01 30.36,11.61 30.36,17.31 31.76,18.71 R13.1
  Bottom Layer w0.175: v2(26.66,11.01) 22.91,11.01 22.76,11.16 22.06,11.16 21.06,12.16 U8.4
LED_STRIP: length 10.8
  Top Layer w0.175: v2(19.81,26.01) 19.91,25.91 23.86,25.91 24.48,25.3 24.48,25.29 24.8,24.98 24.8,24.98 24.87,24.91 v2(26.86,24.91)
  Bottom Layer w0.175: v2(26.86,24.91) 26.14,24.18 25.71,24.18 ; U8.41 19.18,24.68 19.18,25.58 19.61,26.01 v2(19.81,26.01)
MCU_OSCI: length 7
  Bottom Layer w0.175: X2.1 16.76,9.11 17.62,9.97 18.47,9.97 20.56,12.06 U8.5
MCU_OSCO: length 10.3
  Bottom Layer w0.175: U8.6 20.06,11.96 18.36,10.25 17.5,10.25 17.23,9.98 14.45,9.98 X2.3 13.57,10.86 C15.2
NRST: length 4.3
  Top Layer w0.175: 17.31,11.18 17.31,10.71 v2(17.29,10.69)
  Bottom Layer w0.175: U8.7 19.56,12.16 18.09,10.69 v2(17.29,10.69)
OSD_HSYNC: length 1.5
  Top Layer w0.175: R25.1 22.11,22.8 arc(22.1,22.72) 22.05,22.65
OSD_LOS: length 5
  Top Layer w0.175: R24.1 25.77,16.61 24.37,18.02 22.92,18.02 22.7,17.8 22.7,16.92
OSD_OSCI: length 3.3
  Top Layer w0.175: X1.3 17.96,14.26 18.13,14.43 18.13,15.86 18.15,15.89 U5.5
OSD_OSCO: length 1.6
  Top Layer w0.175: U5.6 18.8,15.38 X1.1
OSD_RST: length 1.5
  Top Layer w0.175: 21.4,22.65 21.4,23.39 arc(21.33,23.77) R27.1
OSD_SAG: length 1.5
  Top Layer w0.175: 17.5,22.65 17.5,23.15 arc(17.4,23.66) C46.1
OSD_VOUT: length 1.7
  Top Layer w0.175: C45.1 16.35,23.84 arc(16.72,23.29) 16.85,22.65
OSD_VSYNC: length 1.5
  Top Layer w0.175: 22.7,22.65 22.7,23.08 arc(22.81,23.62) R26.1
OTG_FS_DM: length 20.6
  Inner2 w0.16: v2(10.44,18.83) 12.03,18.83 arc(12.08,18.85) 12.09,18.89 arc(12.11,18.94) 12.15,18.95 12.43,18.95 arc(12.48,18.94) 12.49,18.89 12.49,18.07 arc(12.69,17.87) 12.89,18.07 12.89,18.89 arc(12.91,18.94) 12.95,18.95 13.23,18.95 arc(13.28,18.94) 13.29,18.89 13.29,18.07 arc(13.49,17.87) 13.69,18.07 13.69,18.63 arc(13.75,18.77) 13.89,18.83 14.42,18.83 14.43,18.81 14.79,18.81 14.81,18.83 17.93,18.83 v2(19.68,20.58)
  Bottom Layer w0.16: 9.52,18.06 10.07,18.06 10.32,18.32 10.32,18.71 v2(10.44,18.83) 10.4,18.83 10.16,19.06 9.52,19.06 ; v2(19.68,20.58) 20.56,21.47 U8.44
OTG_FS_DP: length 21.1
  Inner2 w0.16: v2(8.14,18.51) 8.89,19.26 13.96,19.26 14.41,19.71 15.06,19.71 15.61,19.16 16.26,19.16 16.63,19.53 16.63,19.54 16.89,19.79 16.89,19.79 17.01,19.91 18.31,19.91 19.41,21.01 v2(20.76,21.01)
  Bottom Layer w0.16: 8.58,18.56 8.56,18.58 8.56,19.41 8.71,19.56 9.52,19.56 ; 8.58,18.56 9.52,18.56 ; 8.58,18.56 8.19,18.56 v2(8.14,18.51) ; U8.45 21.06,21.31 v2(20.76,21.01)
PINIO1: length 8.3
  Top Layer w0.175: v2(25.81,14.56) 26.37,14.56 26.91,15.1 28.15,15.1 CN4.3
  Inner2 w0.175: v2(25.81,14.56) v2(23.21,14.56)
  Bottom Layer w0.175: v2(23.21,14.56) 22.16,14.56 21.56,13.97 U8.3
PWM_1: length 10.4
  Inner2 w0.175: v2(17.46,26.49) 17.46,22.49 16.01,21.04 16.01,19.76 v2(15.91,19.66)
  Bottom Layer w0.175: v2(15.91,19.66) 15.89,19.69 14.09,19.69 13.96,19.56 U8.26
PWM_2: length 10.4
  Inner2 w0.175: v2(16.5,20.16) 16.5,21.14 18.06,22.7 v2(18.06,26.47)
  Bottom Layer w0.175: U8.27 13.1,20.1 16.45,20.1 v2(16.5,20.16)
PWM_3: length 2
  Bottom Layer w0.175: U8.39 18.06,25.47 18.45,25.85 18.46,25.85 18.58,25.97 18.58,26.32 RN1.7
PWM_4: length 2
  Bottom Layer w0.175: U8.40 18.56,25.56 19.06,26.06 RN1.8
PWM_7: length 2.1
  Bottom Layer w0.175: U8.29 v2(15.16,21.06)
PWM_8: length 2.8
  Bottom Layer w0.175: U8.30 14.72,21.56 14.74,21.54 15.11,21.54 15.13,21.56 15.71,21.56 v2(15.81,21.46)
RX_PPM_PIN: length 8.8
  Top Layer w0.175: v2(12.51,8.71) 12.78,8.71 CN3.1
  Inner2 w0.175: v2(14.06,13.41) 14.06,13.31 14.43,12.95 14.43,10.63 v2(12.51,8.71)
  Bottom Layer w0.175: U8.17 14.06,14.06 v2(14.06,13.41)
SBUS: length 0.9
  Top Layer w0.175: v2(28.43,19.16) 28.97,19.7 R31.1
SDCARD_CS: length 11.4
  Top Layer w0.175: v2(29.71,24.76) 28.96,25.52 U9.1
  Bottom Layer w0.175: U8.50 26.76,22.06 27.5,22.8 29.35,22.8 29.71,23.16 v2(29.71,24.76)
SENS_CUR1: length 22.7
  Inner1 w0.175: v2(18.56,20.86) 19.21,20.21 19.21,12.69 v2(17.94,11.41)
  Inner2 w0.175: v2(19.71,26.56) 19.41,26.56 19.24,26.39 19.24,25.89 19.41,25.71 19.41,21.71 v2(18.56,20.86)
  Bottom Layer w0.175: CN7.8 22.31,27.79 22.21,27.68 22.21,27.11 21.66,26.56 v2(19.71,26.56) ; 17.96,11.41 18.56,12.01 U8.9
SENS_VOL: length 9.8
  Bottom Layer w0.175: R2.1 R3.2 11.54,12.98 14.25,12.98 14.56,13.29 14.56,14.06 14.86,14.36 17.71,14.36 18.06,14.01 U8.10
SPI1_IMU1_CS: length 13
  Top Layer w0.175: v2(20.26,10.51) 20.71,10.96 U6.12
  Inner2 w0.175: v2(14.91,15.88) 18.2,15.88 20.79,13.29 20.79,11.04 v2(20.26,10.51)
  Bottom Layer w0.175: v2(14.91,15.88) 14.75,15.88 14.06,16.56 U8.20
SPI1_IMU1_EXTI: length 14.5
  Top Layer w0.175: v2(21.91,15.26) 22.51,14.66 22.51,13.05 U6.4
  Bottom Layer w0.175: v2(21.91,15.26) 21.91,18.11 21.41,18.61 16.26,18.61 16.21,18.56 U8.24 13.12,18.61
SPI1_MISO: length 16.4
  Top Layer w0.175: U6.1 v2(23.06,11.51)
  Inner2 w0.175: v2(23.06,11.51) 22.76,11.81 22.76,15.91 21.16,17.51 v2(21.16,18.16)
  Bottom Layer w0.175: v2(21.16,18.16) 20.56,17.56 U8.22
SPI1_MOSI: length 15.3
  Top Layer w0.175: U6.14 v2(21.71,10.51)
  Inner2 w0.175: v2(21.71,10.51) 21.34,10.89 21.34,14.09 18.66,16.76 v2(18.66,18.16)
  Bottom Layer w0.175: U8.23 13.17,18.16 v2(18.66,18.16)
SPI1_SCLK: length 14.2
  Top Layer w0.175: v2(21.06,10.46) 21.21,10.61 U6.13
  Inner2 w0.175: v2(19.91,14.81) 21.06,13.66 v2(21.06,10.46)
  Bottom Layer w0.175: U8.21 19.01,17.06 19.91,16.16 v2(19.91,14.81)
SPI2_MISO: length 12.1
  Top Layer w0.175: v2(22.01,19.26) 22.01,19.26 22.07,19.21 22.07,16.93 U5.11
  Bottom Layer w0.175: v2(22.01,19.26) 21.51,19.77 18.29,19.77 17.39,20.68 17.39,21.73 16.01,23.11 16.01,24.51 U8.35
SPI2_MOSI: length 11
  Top Layer w0.175: v2(20.76,20.26) 20.76,18.39 20.73,18.35 20.73,17.98 20.76,17.94 20.76,16.93 U5.9
  Bottom Layer w0.175: v2(20.76,20.26) 19.98,20.26 19.86,20.14 18.31,20.14 17.66,20.79 17.66,21.85 16.56,22.95 U8.36
SPI2_SCLK: length 12
  Top Layer w0.175: v2(21.33,19.31) 21.61,19.02 21.61,17.99 21.4,17.78 U5.10
  Bottom Layer w0.175: v2(21.33,19.31) 21.14,19.49 18.18,19.49 17.11,20.56 17.11,21.61 15.56,23.16 U8.34
SPI3_MISO: length 15.1
  Top Layer w0.175: U9.2 25.84,24.26 v2(30.61,24.26)
  Bottom Layer w0.175: v2(30.61,24.26) 30.61,20.66 29.76,19.81 27.56,19.81 26.81,19.06 U8.56
SPI3_MOSI: length 10.1
  Top Layer w0.175: U9.5 31.36,21.71 v2(31.16,21.51)
  Bottom Layer w0.175: U8.57 28.91,18.56 31.16,20.81 v2(31.16,21.51)
SPI3_SCLK: length 8.6
  Top Layer w0.175: v2(30.16,21.36) 31.71,22.91 31.81,22.91
  Bottom Layer w0.175: v2(30.16,21.36) 30.11,21.36 29.56,20.81 27.66,20.81 27.63,20.79 27.24,20.79 26.01,19.56 U8.55
SPI_OSD_CS: length 18
  Top Layer w0.175: R28.1 24.17,15.81 24.17,15.81 20.58,15.81 20.58,15.81 20.26,15.81 20.1,15.98 U5.8 20.1,19.04 v2(20.11,19.05)
  Bottom Layer w0.175: v2(20.11,19.05) 20.08,19.02 18.26,19.02 16.83,20.45 16.83,21.5 15.06,23.26 U8.33
UART2_TX: length 6.1
  Top Layer w0.175: CN3.2 14.33,8.35 v2(14.51,8.16)
  Inner2 w0.175: v2(14.51,8.16) 14.51,8.21 15.01,8.71 15.01,12.76 v2(14.91,12.86)
UART3_RX: length 3.9
  Bottom Layer w0.175: CN9.4 27.76,21.31 27.51,21.06 U8.52
UART3_TX: length 19.7
  Top Layer w0.175: CN2.2 15.31,27.61 v2(15.06,27.36)
  Inner2 w0.175: v2(15.06,27.36) 15.06,27.04 15.29,26.81 17.11,26.81 17.3,27 19.9,27 19.94,26.96 20.56,26.96 22.41,25.11 v2(22.41,21.46)
  Bottom Layer w0.175: v2(22.41,21.46) 22.51,21.56 U8.51 27.01,21.56 27.76,22.31 CN9.3
UART4_RX: length 8.4
  Top Layer w0.175: v2(15.56,13.06) 15.56,12.91 15.91,12.57 ; 15.91,12.57 17.68,12.57 18.38,11.87 18.38,10.25 19.36,9.26 CN5.1
UART4_TX: length 11.2
  Top Layer w0.175: v2(16.06,13.61) 16.06,12.95 16.16,12.85 17.8,12.85 18.66,11.99 18.66,10.6 19.49,9.76 v2(19.86,9.76) ; CN5.2 22.41,9.36 v2(22.41,10.71)
  Inner2 w0.175: v2(19.86,9.76) 21.66,9.76 22.41,10.51 v2(22.41,10.71)
UART5_RX: length 18.7
  Top Layer w0.175: Q1.3 25.56,19.81 v2(26.11,20.36) 29.55,20.36 R29.2
  Inner2 w0.175: v2(23.01,21.06) 23.01,24.91 20.7,27.22 v2(20.7,27.46)
  Bottom Layer w0.175: v2(26.11,20.36) 25.81,20.06 U8.54 24.45,20.18 23.55,20.18 23.01,20.71 v2(23.01,21.06) ; v2(20.7,27.46) 20.83,27.59 20.83,27.75 21.08,28.01 21.29,28.01 21.31,28.03 CN7.7
UART6_RX: length 14.6
  Top Layer w0.175: v2(16.55,30.77) 16.72,30.61 21.39,30.61 21.43,30.56 21.46,30.56 23.3,28.73 CN10.2
  Inner2 w0.175: v2(16.55,30.77) 16.97,30.36 v2(16.97,27.3)
  Bottom Layer w0.175: v2(16.97,27.3) 16.97,26.06 17.56,25.47 U8.38
  vias: v2(23.27,28.04)
UART6_TX: length 17.4
  Top Layer w0.175: v2(15.76,30.77) 15.76,30.86 16.11,31.21 16.89,31.21 17.17,30.93 22.2,30.93 24.4,28.73 24.4,28.14 v2(24.3,28.04)
  Inner2 w0.175: v2(16.36,27.31) 16.36,30.21 15.81,30.77 v2(15.76,30.77)
  Bottom Layer w0.175: U8.37 17.06,25.57 16.6,26.03 16.6,26.95 16.36,27.19 v2(16.36,27.31)
VCAP1: length 3
  Bottom Layer w0.175: U8.31 12.05,22.06 10.76,23.36 10.64,23.36
VCAP2: length 2.2
  Bottom Layer w0.175: C28.1 22.58,26.43 22.06,25.91 U8.47
VIDIN: length 1.5
  Top Layer w0.175: 19.45,22.65 19.45,23.27 arc(19.36,23.71) C47.1
VTX: length 3.9
  Top Layer w0.175: 15.11,24.95 15.66,25.5 15.66,27.31 16.31,27.96 CN2.1
$1N935: length 1.9
  Top Layer w0.175: R31.2 28.1,17.86 Q1.1
$1N953:
  vias: v2(32.03,26.96)
$1N1962: length 2.4
  Top Layer w0.175: R30.1 15.18,24.08 16.05,24.95 C45.2 C46.2
$1N3690: length 1.2
  Bottom Layer w0.175: 24.81,12.48 25.75,12.48 U4.5
$1N5313: length 1.6
  Top Layer w0.175: R5.2 9.24,15.24 U3.8
$1N5318: length 2
  Top Layer w0.175: R17.2 R20.2 R18.1
$1N5320: length 1.8
  Top Layer w0.175: 11.74,17.87 12.41,17.87 R7.2
$1N5321: length 1.7
  Top Layer w0.175: 11.74,18.52 12.75,18.52 C26.1
$1N5322: length 4.6
  Top Layer w0.175: C17.2 9.07,14.1 9.55,14.58 9.56,14.58 9.94,14.95 R5.1 10.26,15.39 10.26,16.25 11.23,17.21 11.74,17.21 11.74,17.22
$1N5325: length 1.3
  Top Layer w0.175: C26.2 14.1,18.13 13.23,19 R9.2
$1N5344: length 1.6
  Top Layer w0.175: 9.07,21.01 9.24,21.18 9.24,22.51
$1N5352: length 2
  Top Layer w0.175: R16.1 R19.2 R15.2
$1N5360: length 1.8
  Top Layer w0.175: 11.74,23.81 12.41,23.81 R6.2
$1N5361: length 4.9
  Top Layer w0.175: 9.07,20.02 9.07,20.12 9.94,20.98 9.94,21.01 10.11,21.01 10.26,21.16 10.26,22.61 10.81,23.16 11.74,23.16
$1N5362: length 1.7
  Top Layer w0.175: 13.23,23.98 12.75,24.46 11.74,24.46
$1N5363: length 1
  Top Layer w0.175: R8.2 14.1,23.98
$1N5613: length 2.2
  Bottom Layer w0.175: 9.52,20.06 10.46,20.06 11.11,20.71 11.11,21.03
$1N5614: length 1.9
  Bottom Layer w0.175: R22.2 10.85,16.25 10.03,17.06 9.52,17.06
$1N22853: length 1.4
  Top Layer w0.175: R13.2 33.01,18.73 LED5.2
$1N22855: length 8.2
  Bottom Layer w0.175: 26.81,32.06 26.81,28.46 26.16,27.81 25.51,27.81 25.26,27.56 25.26,25.64 25.47,25.43 25.47,25.29 R11.2
  vias: v2(26.81,32.06)
$1N53168: length 1.3
  Bottom Layer w0.175: RN1.4 17.56,27.36 17.31,27.61 CN7.3
$1N53172: length 1.3
  Bottom Layer w0.175: RN1.3 18.06,27.51 18.31,27.76 CN7.4
$1N53177: length 1.5
  Bottom Layer w0.175: CN7.5 19.31,28.16 19.01,27.86 19,27.86 18.68,27.54 18.68,27.3 RN1.2
$1N53182: length 2.3
  Bottom Layer w0.175: RN1.1 20.04,27.19 20.26,27.41 20.26,28.36 CN7.6
$1N59217: length 3.4
  Top Layer w0.175: v2(13.46,6.36) 13.36,6.36 13.16,6.56 v2(11.81,6.56)
  Bottom Layer w0.175: v2(13.46,6.36) 13.31,6.21 U10.8
$1N59218: length 1.3
  Bottom Layer w0.175: U10.12 12.1,7.51 11.9,7.51 C51.1
$1N59220: length 1.7
  Bottom Layer w0.175: U10.10 12.51,5.81 11.61,4.91 C49.1

## Copper pours and planes (outline as drawn; the poured copper is in the pictures)
4V5 on Top Layer: 17.1,8.97 19.11,8.97 19.11,7.41 17.1,7.41
5V_BEC on Top Layer: 5.86,21.26 8.23,21.26 8.23,19.64 12.58,19.64 12.58,19.08 12.41,18.91 8.06,18.91 7.11,19.86 5.86,19.86
5V_BEC on Bottom Layer: 5.21,19.81 5.21,21.56 5.81,22.16 5.81,24.91 5.41,25.31 5.41,25.96 6.51,25.96 6.51,19.81
5V_BEC on Inner1: 5.21,21.21 6.61,21.21 6.61,19.86 5.21,19.86
9V_BEC on Top Layer: 10.51,14.31 13.56,14.31 13.56,13.41 10.51,13.41
9V_BEC on Top Layer: 8.76,13.96 11.5,13.96 11.5,12.46 8.76,12.46
9V_BEC on Top Layer: 8.16,15.31 8.16,15.31 8.16,13.64 10.28,13.64 10.28,11.62 7.3,11.62 7.3,13.42 7.16,13.56 5.62,13.56 5.61,13.56 5.61,15.31
9V_BEC on Top Layer: 4.26,15.31 5.76,15.31 5.76,12.76 4.26,12.76
9V_BEC on Inner1: 4.71,15.56 6.86,15.56 6.86,14.56 4.71,14.56
9V_BEC on Inner2: 7.35,13.49 9.26,13.49 9.26,11.61 7.35,11.61
GND on Top Layer: 8.95,16.05 14.1,16.05 14.1,14.07 8.95,14.07
GND on Top Layer: 8.95,22.05 14.1,22.05 14.1,20.06 8.95,20.06
GND on Top Layer: -1.74,42.36 38.61,42.36 38.61,-7.84 -1.74,-7.84
GND on Bottom Layer: -9.84,39.21 38.91,39.21 38.91,-0.99 -9.84,-0.99
GND on Inner1: 4.26,3.66 34.26,3.66 34.26,33.66 4.26,33.66
VBAT on Top Layer: 10.03,17.54 10.03,16.91 6.86,16.91 6.86,16.34 5.41,16.34 5.41,17.54
VBAT on Top Layer: 7.28,21.92 8.14,21.92 9.15,22.93 10.03,22.93 10.03,23.39 8.15,23.39 8.05,23.49 7.28,23.49
VBAT on Bottom Layer: 11.42,28.38 14.33,28.38 14.36,28.41 14.36,29.23 15.8,29.23 15.81,29.21 15.81,27.65 16.84,27.65 16.84,27.66 16.84,29.24 23.39,29.24 23.41,29.21 23.41,28.44 26.18,28.44 26.18,30.61 12.11,30.61 11.41,29.91 11.41,28.38
VBAT on Inner2: 11.22,30.08 13.41,30.08 13.41,28.08 11.22,28.08
VBAT on Inner2: 7.01,23.46 8.53,23.46 8.53,21.78 7.01,21.78
VDD_MCU on Top Layer: 23.62,14.49 25.31,14.49 25.31,12.86 23.62,12.86
VDD_MCU on Top Layer: 15.41,25.72 12.62,25.72 12.61,25.71 12.61,27.01 12.46,27.16 11.63,27.16 11.63,27.93 11.66,27.96 12.71,27.96 13.56,27.11 15.41,27.11
VDD_MCU on Bottom Layer: 26.86,16.33 27.81,16.33 27.81,14.51 26.86,14.51
VDD_MCU on Bottom Layer: 12.61,26.86 14.26,26.86 14.26,25.21 12.61,25.21
VDD_MCU on Bottom Layer: 28.86,13.56 31.96,13.56 31.96,13.06 28.86,13.06
VDD_MCU on Inner2: 3.81,3.81 33.81,3.81 33.81,33.81 3.81,33.81
LC_5V on Top Layer: 5.01,25.4 7.21,25.4 7.21,24.3 7.41,24.1 9.91,24.1 10.11,23.9 10.11,23.8 9.91,23.6 5.39,23.6 5.01,23.9
LC_9V on Top Layer: 5.01,19.41 7.21,19.41 7.21,18.31 7.41,18.11 9.91,18.11 10.11,17.91 10.11,17.81 9.91,17.61 5.39,17.61 5.01,17.91

Small or netless copper shapes (teardrops, artwork), in the pictures only: 3 on Inner1

## Text on the board
Bottom Solder Mask Layer: 20250626 | F435 V0.25 | Urmouky
Bottom Silkscreen Layer: G-B-1-2-3-4-R5-C | T-R-V-G | ESC | 9V-G-T-R-G-S | DJI | I2C1 | Boot
Top Silkscreen Layer: VO-R3-G-9V | UART2 | UART4 | Camera | VTX | UART6 | R-T-V-G | G-D-C-V
